# EAGLE design netCPU (EAGLE 6.3)
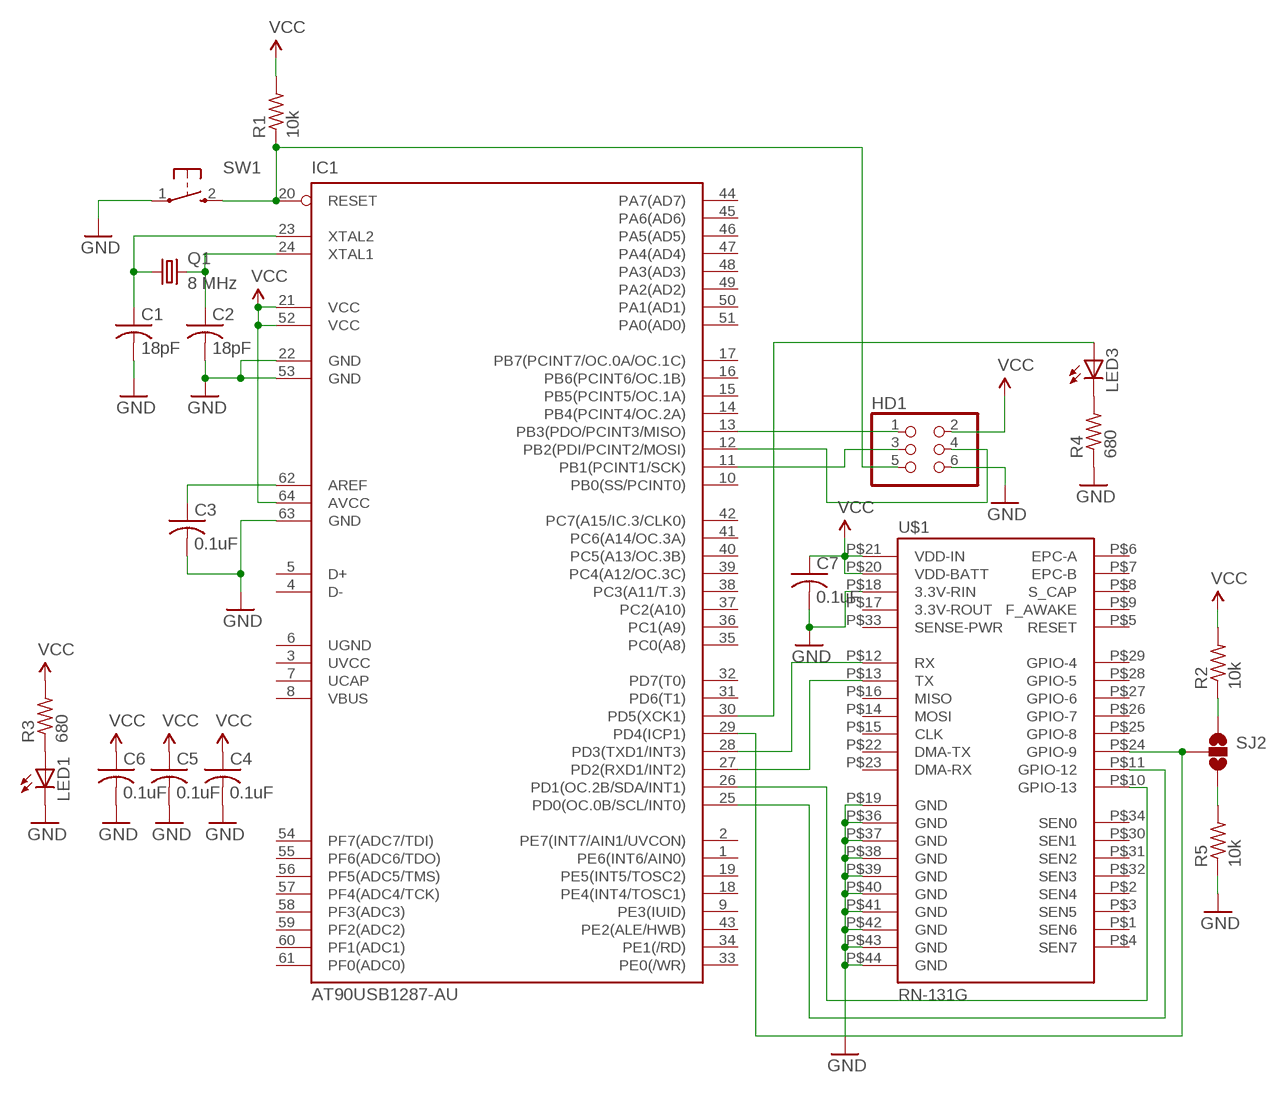
[diagram p0: schematic, sheet 1]

## Parts
C1  18pF  C-USC0603K  [C0603K]
C2  18pF  C-USC0603K  [C0603K]
C3  0.1uF  C-USC0603K  [C0603K]
C4  0.1uF  C-USC0603K  [C0603K]
C5  0.1uF  C-USC0603K  [C0603K]
C6  0.1uF  C-USC0603K  [C0603K]
C7  0.1uF  C-USC0603K  [C0603K]
HD1  HEADER2X3  [HEADER2X3]
IC1  AT90USB1287-AU  [TQFP64]
LED1  LEDCHIP-LED0603  [CHIP-LED0603]
LED3  LEDCHIP-LED0603  [CHIP-LED0603]
Q1  8 MHz  CRYSTALHC49UP  [HC49UP]
R1  10k  R-US_R0603  [R0603]
R2  10k  R-US_R0603  [R0603]
R3  680  R-US_R0603  [R0603]
R4  680  R-US_R0603  [R0603]
R5  10k  R-US_R0603  [R0603]
SJ2  SOLDERJUMPER_2WAYPASTE2&3  [SJ_3_PASTE2&3]
SW1  TAC-SWITCH  [TAC-SWITCH]
U$1  RN-131G  [RN-131G]

## Nets
GND: C1.2 C2.2 C3.2 C4.2 C5.2 C6.2 C7.2 HD1.6 IC1.22(GND) IC1.53(GND) IC1.63(GND) LED1.C R4.1 R5.1 SW1.1 U$1.P$18(3.3V-RIN) U$1.P$19(GND) U$1.P$36(GND) U$1.P$37(GND) U$1.P$38(GND) U$1.P$39(GND) U$1.P$40(GND) U$1.P$41(GND) U$1.P$42(GND) U$1.P$43(GND) U$1.P$44(GND)
N$1: C1.1 IC1.23(XTAL2) Q1.1
N$2: C2.1 IC1.24(XTAL1) Q1.2
N$3: HD1.1 IC1.13(PB3(PDO/PCINT3/MISO))
N$4: HD1.5 IC1.20(RESET) R1.1 SW1.2
N$5: HD1.4 IC1.12(PB2(PDI/PCINT2/MOSI))
N$6: IC1.28(PD3(TXD1/INT3)) U$1.P$12(RX)
N$7: HD1.3 IC1.11(PB1(PCINT1/SCK))
N$8: C3.1 IC1.62(AREF)
N$9: IC1.27(PD2(RXD1/INT2)) U$1.P$13(TX)
N$10: IC1.26(PD1(OC.2B/SDA/INT1)) U$1.P$10(GPIO-13)
N$11: IC1.25(PD0(OC.0B/SCL/INT0)) U$1.P$11(GPIO-12)
N$12: LED1.A R3.1
N$13: IC1.29(PD4(ICP1)) SJ2.2 U$1.P$24(GPIO-9)
N$14: LED3.C R4.2
N$15: IC1.30(PD5(XCK1)) LED3.A
N$17: R5.2 SJ2.3
N$18: R2.1 SJ2.1
VCC: C4.1 C5.1 C6.1 C7.1 HD1.2 IC1.21(VCC) IC1.52(VCC) IC1.64(AVCC) R1.2 R2.2 R3.2 U$1.P$20(VDD-BATT) U$1.P$21(VDD-IN)
Unconnected: IC1.1(PE6(INT6/AIN0)) IC1.2(PE7(INT7/AIN1/UVCON)) IC1.4(D-) IC1.5(D+) IC1.9(PE3(IUID)) IC1.10(PB0(SS/PCINT0)) IC1.14(PB4(PCINT4/OC.2A)) IC1.15(PB5(PCINT5/OC.1A)) IC1.16(PB6(PCINT6/OC.1B)) IC1.17(PB7(PCINT7/OC.0A/OC.1C)) IC1.18(PE4(INT4/TOSC1)) IC1.19(PE5(INT5/TOSC2)) IC1.31(PD6(T1)) IC1.32(PD7(T0)) IC1.33(PE0(/WR)) IC1.34(PE1(/RD)) IC1.35(PC0(A8)) IC1.36(PC1(A9)) IC1.37(PC2(A10)) IC1.38(PC3(A11/T.3)) IC1.39(PC4(A12/OC.3C)) IC1.40(PC5(A13/OC.3B)) IC1.41(PC6(A14/OC.3A)) IC1.42(PC7(A15/IC.3/CLK0)) IC1.43(PE2(ALE/HWB)) IC1.44(PA7(AD7)) IC1.45(PA6(AD6)) IC1.46(PA5(AD5)) IC1.47(PA4(AD4)) IC1.48(PA3(AD3)) IC1.49(PA2(AD2)) IC1.50(PA1(AD1)) IC1.51(PA0(AD0)) IC1.54(PF7(ADC7/TDI)) IC1.55(PF6(ADC6/TDO)) IC1.56(PF5(ADC5/TMS)) IC1.57(PF4(ADC4/TCK)) IC1.58(PF3(ADC3)) IC1.59(PF2(ADC2)) IC1.60(PF1(ADC1)) IC1.61(PF0(ADC0)) U$1.P$1(SEN6) U$1.P$2(SEN4) U$1.P$3(SEN5) U$1.P$4(SEN7) U$1.P$5(RESET) U$1.P$6(EPC-A) U$1.P$7(EPC-B) U$1.P$8(S_CAP) U$1.P$9(F_AWAKE) U$1.P$14(MOSI) U$1.P$15(CLK) U$1.P$16(MISO) U$1.P$17(3.3V-ROUT) U$1.P$22(DMA-TX) U$1.P$23(DMA-RX) U$1.P$25(GPIO-8) U$1.P$26(GPIO-7) U$1.P$27(GPIO-6) U$1.P$28(GPIO-5) U$1.P$29(GPIO-4) U$1.P$30(SEN1) U$1.P$31(SEN2) U$1.P$32(SEN3) U$1.P$33(SENSE-PWR) U$1.P$34(SEN0)

## Power pins joined to a net without a drawn wire
UCAP: IC1.7(UCAP)
UGND: IC1.6(UGND)
UVCC: IC1.3(UVCC)
VBUS: IC1.8(VBUS)

## Library data of the parts
C1-C7 = rcl:C-US: CAPACITOR, American symbol
HD1 = jkf-parts:HEADER2X3
IC1 = at90usb:AT90USB1287-*: Atmel AT90USB1287 AVR Microcontroller with USB Interface and 128kB Flash Memory
LED1 LED3 = adafruit:LED: LED OSRAM: - CHIPLED LG R971, LG N971, LY N971, LG Q971, LY Q971, LO R971, LY R971 LH N974, LH R974 LS Q976, LO Q976, LY Q976 LO Q996 - Hyper CHIPLED LW Q18S LB Q993, LB Q99A, LB R99A - SideLED LS A670, LO A670, LY A670, LG A670, LP A670 LB A673, LV A673, LT A673, LW A673 LH A674 LY A675 LS A676, LA A676, LO A676, LY A676, LW A676 LS A679, LY A679, LG A679 - Hyper Micro SIDELED® LS Y876, LA Y876, LO Y876, LY Y876 LT Y87S - SmartLED LW L88C, LW L88S LB L89C, LB L89S, LG L890 LS L89K, LO L89K, LY L89K LS L896, LA L896, LO L896, LY L896 - TOPLED LS T670, LO T670, LY T670, LG T670, LP T670 LSG T670, LSP T670, LSY T670, LOP T670, LYG T670 LG T671, LOG T671, LSG T671 LB T673, LV T673, LT T673, LW T673 LH T674 LS T676, LA T676, LO T676, LY T676, LB T676, LH T676, LSB T676, LW T676 LB T67C, LV T67C, LT T67C, LS T67K, LO T67K, LY T67K, LW E67C LS E67B, LA E67B, LO E67B, LY E67B, LB E67C, LV E67C, LT E67C LW T67C LS T679, LY T679, LG T679 LS T770, LO T770, LY T770, LG T770, LP T770 LB T773, LV T773, LT T773, LW T773 LH T774 LS E675, LA E675, LY E675, LS T675 LS T776, LA T776, LO T776, LY T776, LB T776 LHGB T686 LT T68C, LB T68C - Hyper Mini TOPLED® LB M676 - Mini TOPLED Santana® LG M470 LS M47K, LO M47K, LY M47K Source: http://www.osram.convergy.de/
Q1 = crystal:CRYSTAL: CRYSTAL; OC_FARNELL: unknown; OC_NEWARK: unknown
R1-R5 = resistor:R-US_: RESISTOR, American symbol
SJ2 = SparkFun-Passives:SOLDERJUMPER_2WAY: Solder Jumper 2 way solder jumper
SW1 = jkf-parts:TAC-SWITCH
U$1 = SparkFun-RF:RN-131G: Roving Netowrks WiFLy GSX Module

## Board
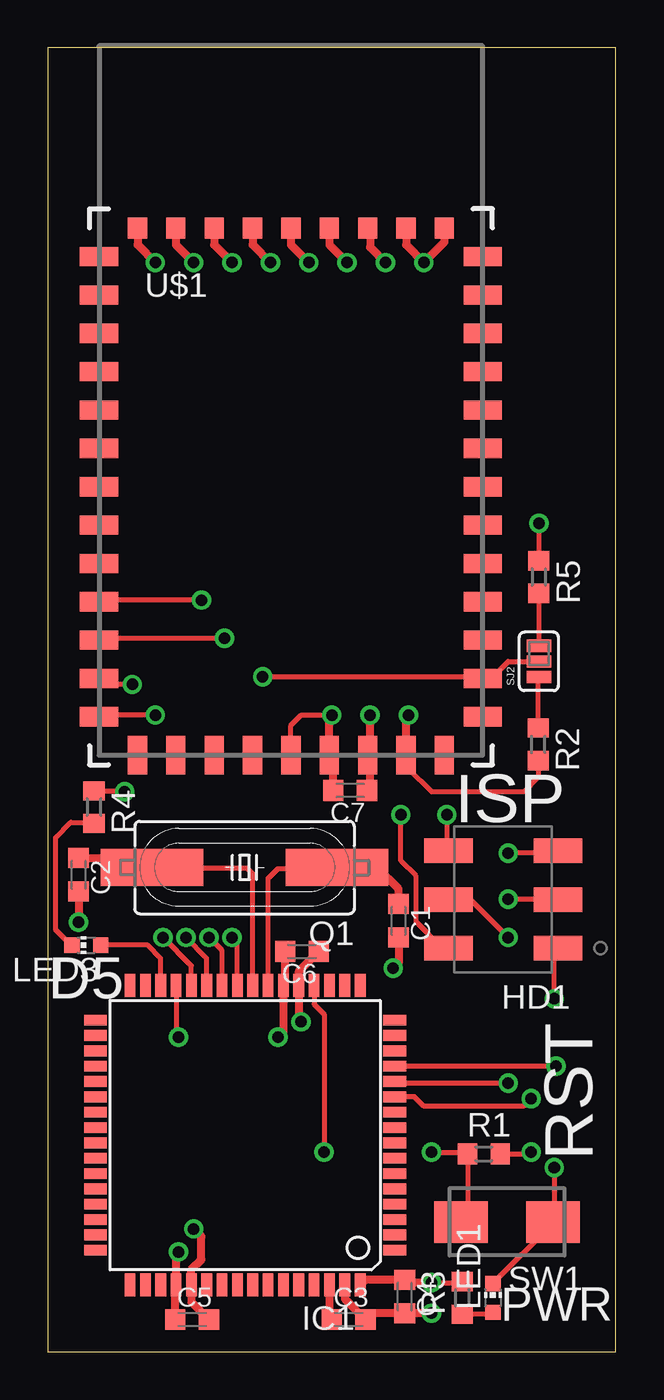
[diagram p1: board, top side]
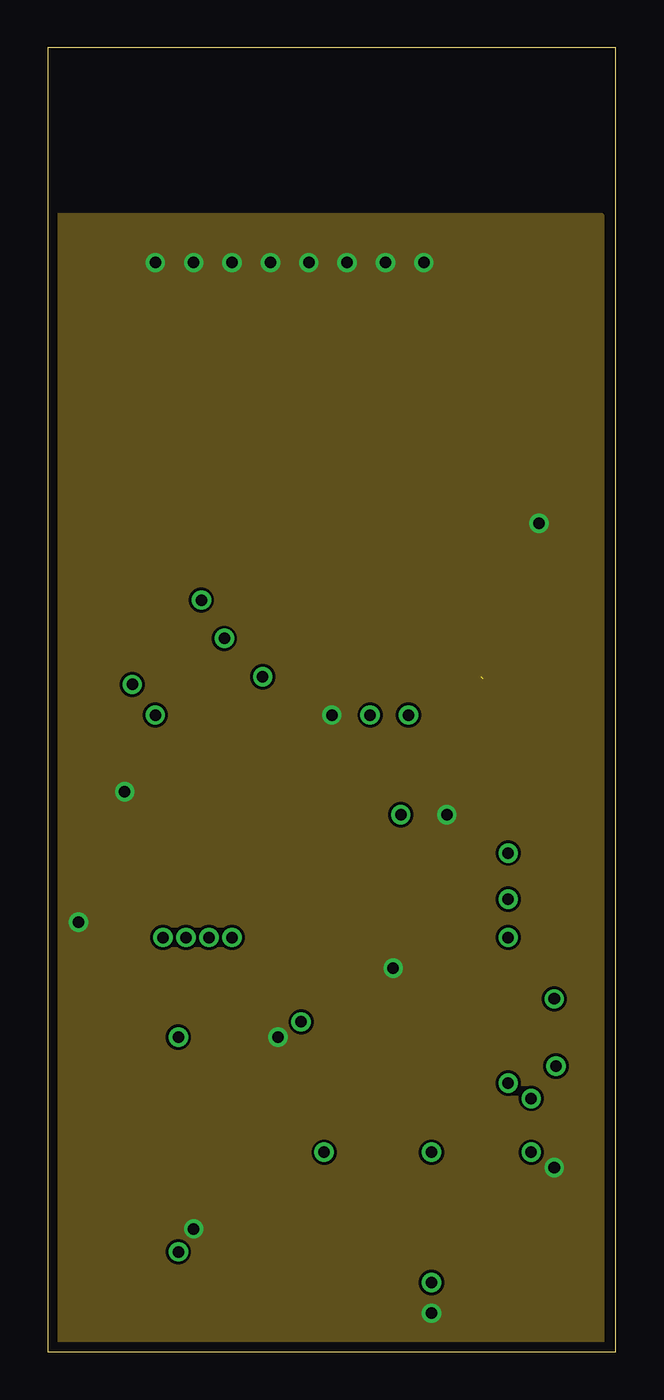
[diagram p2: board, inner layer GND]
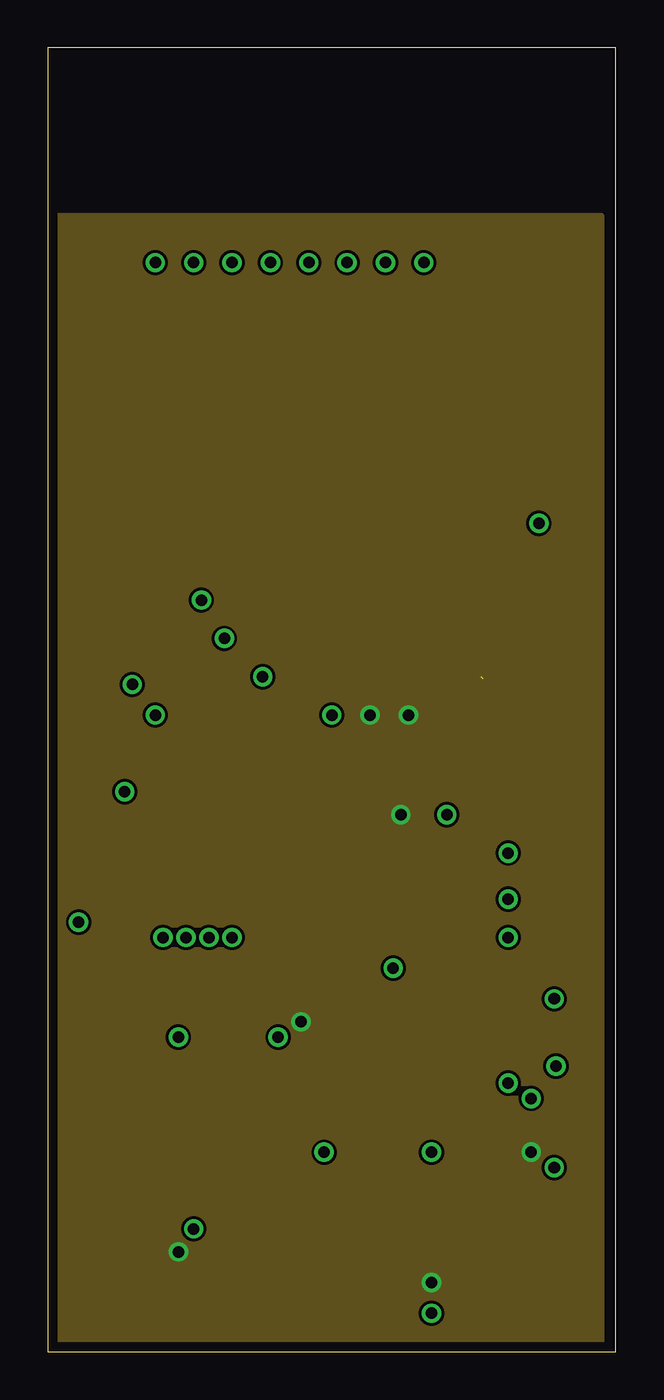
[diagram p3: board, inner layer VCC]
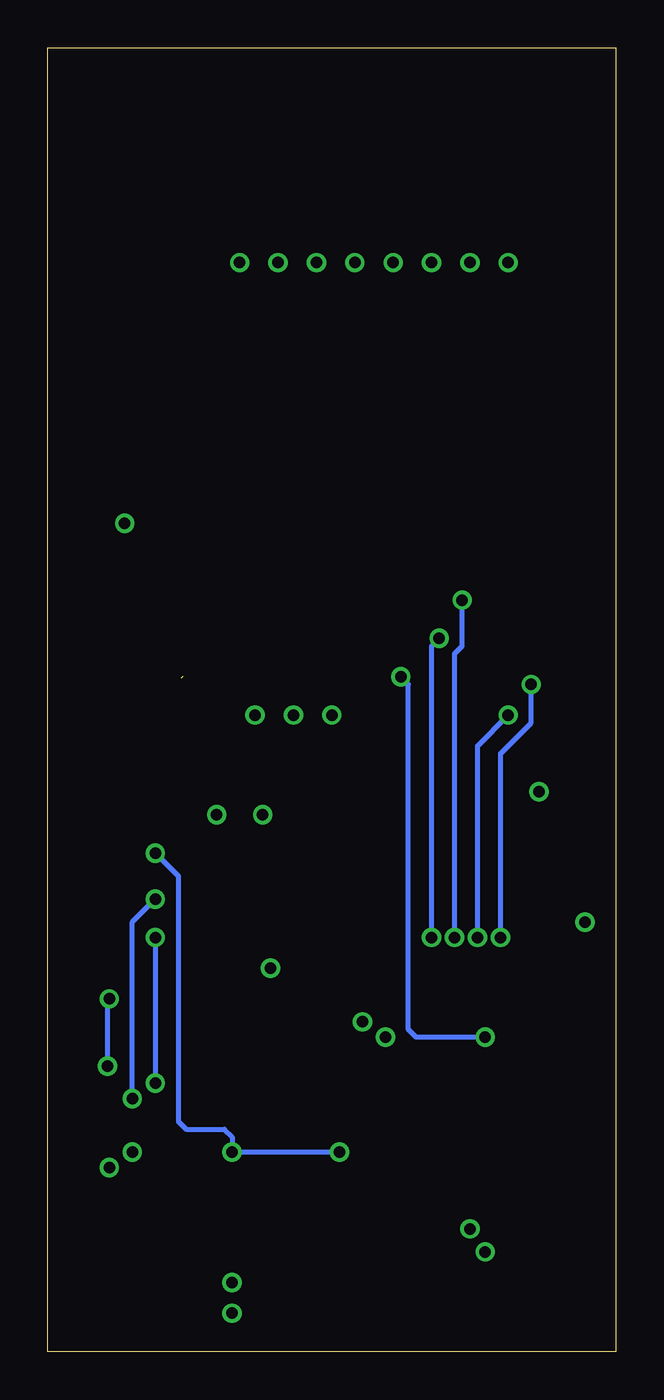
[diagram p4: board, bottom side, seen from below]

Size 29.6 x 68 mm. Coordinates in mm from the lower left corner, seen from the top.
Outline: 0,0 29.6,0 29.6,68 0,68 0,0
Copper layers (1+2*15+16): Top 0.0178mm / dielectric 12mil / GND 0.0356mm / dielectric 28mil / VCC 0.0356mm / dielectric 12mil / Bottom 0.0178mm
Design rules "SSC-EAGLE-4Lyr_v1.0.0.3 *": minimum track width 6mil, minimum drill 8mil, track to track 6mil, track to pad 6mil, pad to pad 6mil, via to via 6mil, smd to smd 6mil, copper to edge 20mil, drill to drill 16mil, minimum pad ring 8mil, minimum via ring 8mil, stop-mask expansion 3mil, vias tented up to drill 0mil, thermal gap 10mil
tKeepout: area 6.5,32.9 to 8.7,35.1; area 15.3,38.1 to 17.5,40.3

### Footprints (pad centres in the part's own frame; a part is rotated, then mirrored left to right if it is on the bottom)
C0603K = smd 1.05 x 1.08: 1 -0.875,0; 2 0.875,0
HEADER2X3 = smd 2.54 x 1.27: 1 -3.175,2.54; 2 2.54,2.54; 3 -3.175,0; 4 2.54,0; 5 -3.175,-2.54; 6 2.54,-2.54
TQFP64 = smd 1.194 x 0.559: 1 -7.8,6; 2 -7.8,5.2; 3 -7.8,4.4; 4 -7.8,3.6; 5 -7.8,2.8; 6 -7.8,2; 7 -7.8,1.2; 8 -7.8,0.4; 9 -7.8,-0.4; 10 -7.8,-1.2; 11 -7.8,-2; 12 -7.8,-2.8; 13 -7.8,-3.6; 14 -7.8,-4.4; 15 -7.8,-5.2; 16 -7.8,-6; 33 7.8,-6; 34 7.8,-5.2; 35 7.8,-4.4; 36 7.8,-3.6; 37 7.8,-2.8; 38 7.8,-2; 39 7.8,-1.2; 40 7.8,-0.4; 41 7.8,0.4; 42 7.8,1.2; 43 7.8,2; 44 7.8,2.8; 45 7.8,3.6; 46 7.8,4.4; 47 7.8,5.2; 48 7.8,6 | smd 0.559 x 1.194: 17 -6,-7.8; 18 -5.2,-7.8; 19 -4.4,-7.8; 20 -3.6,-7.8; 21 -2.8,-7.8; 22 -2,-7.8; 23 -1.2,-7.8; 24 -0.4,-7.8; 25 0.4,-7.8; 26 1.2,-7.8; 27 2,-7.8; 28 2.8,-7.8; 29 3.6,-7.8; 30 4.4,-7.8; 31 5.2,-7.8; 32 6,-7.8; 49 6,7.8; 50 5.2,7.8; 51 4.4,7.8; 52 3.6,7.8; 53 2.8,7.8; 54 2,7.8; 55 1.2,7.8; 56 0.4,7.8; 57 -0.4,7.8; 58 -1.2,7.8; 59 -2,7.8; 60 -2.8,7.8; 61 -3.6,7.8; 62 -4.4,7.8; 63 -5.2,7.8; 64 -6,7.8
CHIP-LED0603 = smd 0.8 x 0.8: A 0,-0.75; C 0,0.75
HC49UP = smd 5.334 x 1.93: 1 -4.826,0; 2 4.826,0
R0603 = smd 1 x 1.1: 1 -0.85,0; 2 0.85,0
SJ_3_PASTE2&3 = smd 0.635 x 1.27: 1 -0.813,0; 2 0,0; 3 0.813,0
TAC-SWITCH = smd 2.8 x 2.16: 1 1.4,1.08; 2 6.2,1.08
RN-131G = smd 2 x 1: P$1 -10,11; P$2 -10,9; P$3 -10,7; P$4 -10,5; P$5 -10,3; P$6 -10,1; P$7 -10,-1; P$8 -10,-3; P$9 -10,-5; P$10 -10,-7; P$11 -10,-9; P$12 -10,-11; P$13 -10,-13; P$23 10,-13; P$24 10,-11; P$25 10,-9; P$26 10,-7; P$27 10,-5; P$28 10,-3; P$29 10,-1; P$30 10,1; P$31 10,3; P$32 10,5; P$33 10,7; P$34 10,9; P$35 10,11 | smd 1 x 2: P$14 -8,-15; P$15 -6,-15; P$16 -4,-15; P$17 -2,-15; P$18 0,-15; P$19 2,-15; P$20 4,-15; P$21 6,-15; P$22 8,-15 | smd 1 x 1.11: P$36 8,12.492; P$37 6,12.492; P$38 4,12.492; P$39 2,12.492; P$40 0,12.492; P$41 -2,12.492; P$42 -4,12.492; P$43 -6,12.492; P$44 -8,12.492

### Placement (x,y rotation side)
C1  18.28,22.47 270 top
C2  1.6,24.87 270 top
C3  15.68,1.67 0 top
C4  18.6,2.87 270 top
C5  7.52,1.67 0 top
C6  13.24,20.87 180 top
C7  15.76,29.27 180 top
HD1  23.42,23.58 180 top
IC1  10.28,11.29 180 top
LED1  23.2,2.8 0 top
LED3  2,21.2 90 top
Q1  10.25,25.25 180 top
R1  22.73,10.31 0 top
R2  25.56,31.67 270 top
R3  660  [R0603]  21.6,2.8 90 top
R4  660  [R0603]  2.4,28.4 270 top
R5  25.6,40.4 270 top
SJ2  25.6,36 90 top
SW1  27.74,7.84 180 top
U$1  12.67,46.11 0 top

### Tracks (layer width: path | path; a pad name or v marks a point on that pad's centre or on a via)
GND  (via drill 0.6, 0.6 pad 0.25)
  Top 0.254: v26.4,9.6 26.4,6.82 SW1.1 26.34,6.69 LED1.C | v20.8,28 20.8,26.2 HD1.6 | U$1.P$18 12.67,32.67 13.2,33.2 v14.8,33.2 | R4.1 3.95,29.25 v4,29.2 | v25.6,43.2 R5.1
  Top 0.406: U$1.P$44 4.67,57.73 v5.6,56.8 | U$1.P$43 6.67,57.73 v7.6,56.8 | U$1.P$42 8.67,57.73 v9.6,56.8 | U$1.P$41 10.67,57.73 v11.6,56.8 | U$1.P$40 12.67,57.73 v13.6,56.8 | U$1.P$39 14.67,57.73 v15.6,56.8 | U$1.P$38 16.67,58.53 16.8,58.4 16.8,57.6 v17.6,56.8 | U$1.P$36 20.67,57.87 v19.6,56.8 18.67,57.73 U$1.P$37 | v14.8,33.2 14.67,33.07 U$1.P$19 14.89,30.9 C7.2 | C2.2 v1.6,22.4 | v7.6,6.4 8,6 8,4.8 7.48,4.28 IC1.53 7.48,2.59 C5.2 | v20,2 C4.2 | C4.2 | C4.2 16.89,2 C3.2 15.48,2.74 IC1.63 | C6.2 12.37,19.17 IC1.22 12.28,16.68 v12,16.4 | C1.2 18.28,20.28 v18,20
  pour GND: 0,59.2 28.8,59.2 28.8,0 0,0
N$1
  Top 0.254: 15.57,25.74 Q1.1 15.03,25.2 12,25.2 11.48,24.68 IC1.23
  Top 0.406: C1.1 18.28,24.12 17.2,25.2 16.12,25.2 15.57,25.74
N$2
  Top 0.254: 4.93,25.74 Q1.2 5.47,25.2 10.4,25.2 10.68,24.92 IC1.24
  Top 0.406: C2.1 4.93,25.74
N$3  (via drill 0.6 pad 0.41)
  Top 0.254: IC1.13 v26.49,14.89 | 26.4,20.84 HD1.1 26.59,20.99 26.4,20.8 v26.4,18.4
  Bottom 0.254: v26.49,14.89 26.49,18.31 v26.4,18.4
N$4  (via drill 0.6 pad 0.25, 0.6 pad 0.41)
  Top 0.254: HD1.5 26.48,26 v24,26 | v20,10.4 21.79,10.4 R1.1 21.88,7.1 SW1.2 | IC1.20 13.88,18.12 14.4,17.6 v14.4,10.4
  Bottom 0.254: v14.4,10.4 v20,10.4 20,11.2 20.4,11.6 22.4,11.6 22.8,12 22.8,24.8 v24,26
N$5  (via drill 0.6 pad 0.41)
  Top 0.254: 20.9,23.6 HD1.4 22.02,23.58 v24,21.6 | v24,14 18.17,14 IC1.12
  Bottom 0.254: v24,21.6 v24,14
N$6  (via drill 0.6 pad 0.41)
  Top 0.254: IC1.28 7.48,20.12 v6,21.6 | v4.4,34.8 2.98,34.8 U$1.P$12
  Bottom 0.254: v6,21.6 6,31.2 4.4,32.8 v4.4,34.8
N$7  (via drill 0.6 pad 0.41)
  Top 0.254: v24,23.6 26.58,23.6 HD1.3 | v25.2,13.2 24.8,12.8 19.6,12.8 19.11,13.29 IC1.11
  Bottom 0.254: v25.2,13.2 25.2,22.4 v24,23.6
N$8
  Top 0.406: IC1.62 14.68,1.8 C3.1
N$9  (via drill 0.6 pad 0.41)
  Top 0.254: IC1.27 8.28,20.52 v7.2,21.6 | v5.6,33.2 2.76,33.2 U$1.P$13
  Bottom 0.254: v7.2,21.6 7.2,31.6 v5.6,33.2
N$10  (via drill 0.6 pad 0.41)
  Top 0.254: IC1.26 9.08,20.92 v8.4,21.6 | v8,39.2 2.76,39.2 U$1.P$10
  Bottom 0.254: v8.4,21.6 8.4,36.4 8,36.8 v8,39.2
N$11  (via drill 0.6 pad 0.41)
  Top 0.254: IC1.25 9.88,21.32 v9.6,21.6 | v9.2,37.2 2.76,37.2 U$1.P$11
  Bottom 0.254: v9.6,21.6 9.6,36.8 v9.2,37.2
N$12
  Top 0.254: 21.9,1.65 R3.1 23.1,1.95 LED1.A
N$13  (via drill 0.6 pad 0.41)  (1 unrouted)
  Top 0.254: IC1.29 6.68,16.52 v6.8,16.4 | v11.2,35.2 22.58,35.2 | U$1.P$24 23.11,35.11 24,36 SJ2.2
  Bottom 0.254: v6.8,16.4 10.4,16.4 10.8,16.8 10.8,34.8 v11.2,35.2
N$14
  Top 0.254: LED3.C 1.2,21.2 0.4,22 0.4,26.8 1.2,27.6 2.35,27.6 R4.2
N$15
  Top 0.254: IC1.30 5.88,20.52 5.2,21.2 LED3.A
N$17
  Top 0.254: R5.2 SJ2.3
N$18
  Top 0.254: R2.1 25.56,35.15 SJ2.1
VCC  (via drill 0.6 pad 0.25)
  Top 0.254: IC1.64 16.28,3.72 | R1.2 25.11,10.31 v25.2,10.4 | HD1.2 20.56,21.04 19.2,22.4 19.2,24.8 18.4,25.6 v18.4,28 | v20,3.6 21.55,3.6 R3.2 | R2.2 25.56,29.96 24.8,29.2 20,29.2 18.8,30.4 18.8,30.98 U$1.P$21
  Top 0.406: v16.8,33.2 16.8,31.11 U$1.P$20 16.8,30.98 16.8,29.6 16.64,29.44 C7.1 | U$1.P$21 18.67,33.07 v18.8,33.2 | v6.8,5.2 6.68,5.08 IC1.52 6.64,3.45 C5.1 | v20,3.6 18.75,3.6 C4.1 16.53,3.74 IC1.64 | C6.1 13.08,19.84 IC1.21 13.08,17.32 v13.2,17.2
  pour VCC: 0,59.2 28.8,59.2 28.8,0 0,0

### Text on the board
_tsilk: ISP | D5 | RST | PWR